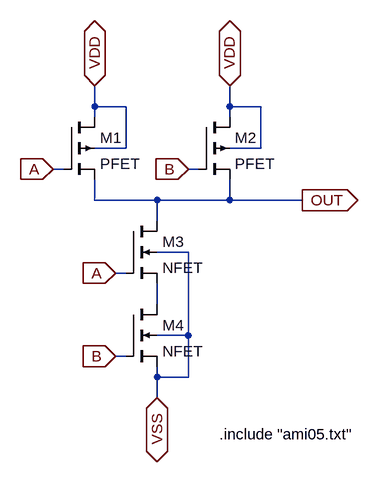
[diagram p0: schematic nand2.asc]
nand2.asc, the LTspice schematic file:
Version 4
SHEET 1 880 680
WIRE 240 0 240 -32
WIRE 288 0 240 0
WIRE 448 0 448 -32
WIRE 496 0 448 0
WIRE 240 16 240 0
WIRE 448 16 448 0
WIRE 288 64 288 0
WIRE 288 64 240 64
WIRE 496 64 496 0
WIRE 496 64 448 64
WIRE 192 96 176 96
WIRE 400 96 384 96
WIRE 240 144 240 112
WIRE 336 144 240 144
WIRE 448 144 448 112
WIRE 448 144 336 144
WIRE 560 144 448 144
WIRE 336 176 336 144
WIRE 384 224 336 224
WIRE 288 256 272 256
WIRE 336 304 336 272
WIRE 384 352 384 224
WIRE 384 352 336 352
WIRE 288 384 272 384
WIRE 336 416 336 400
WIRE 384 416 384 352
WIRE 384 416 336 416
WIRE 336 448 336 416
FLAG 336 448 VSS
IOPIN 336 448 BiDir
FLAG 448 -32 VDD
IOPIN 448 -32 BiDir
FLAG 240 -32 VDD
IOPIN 240 -32 BiDir
FLAG 384 96 B
IOPIN 384 96 In
FLAG 272 384 B
IOPIN 272 384 In
FLAG 272 256 A
IOPIN 272 256 In
FLAG 176 96 A
IOPIN 176 96 In
FLAG 560 144 OUT
IOPIN 560 144 Out
SYMBOL pmos4 192 16 R0
SYMATTR InstName M1
SYMATTR Value PFET
SYMATTR Value2 l=0.6u w=3u
SYMBOL pmos4 400 16 R0
SYMATTR InstName M2
SYMATTR Value PFET
SYMATTR Value2 l=0.6u w=3u
SYMBOL nmos4 288 176 R0
SYMATTR InstName M3
SYMATTR Value NFET
SYMATTR Value2 l=0.6u w=3u
SYMBOL nmos4 288 304 R0
SYMATTR InstName M4
SYMATTR Value NFET
SYMATTR Value2 l=0.6u w=3u
TEXT 432 504 Left 2 !.include "ami05.txt"

The netlist it stands for:
* nand2.asc
M1 VDD A OUT VDD PFET l=0.6u w=3u
M2 VDD B OUT VDD PFET l=0.6u w=3u
M3 OUT A N001 VSS NFET l=0.6u w=3u
M4 N001 B VSS VSS NFET l=0.6u w=3u
.model NMOS NMOS
.model PMOS PMOS
.lib standard.mos
.include "ami05.txt"
.backanno
.end